# EAGLE design SWNUI (EAGLE 7.1.0)
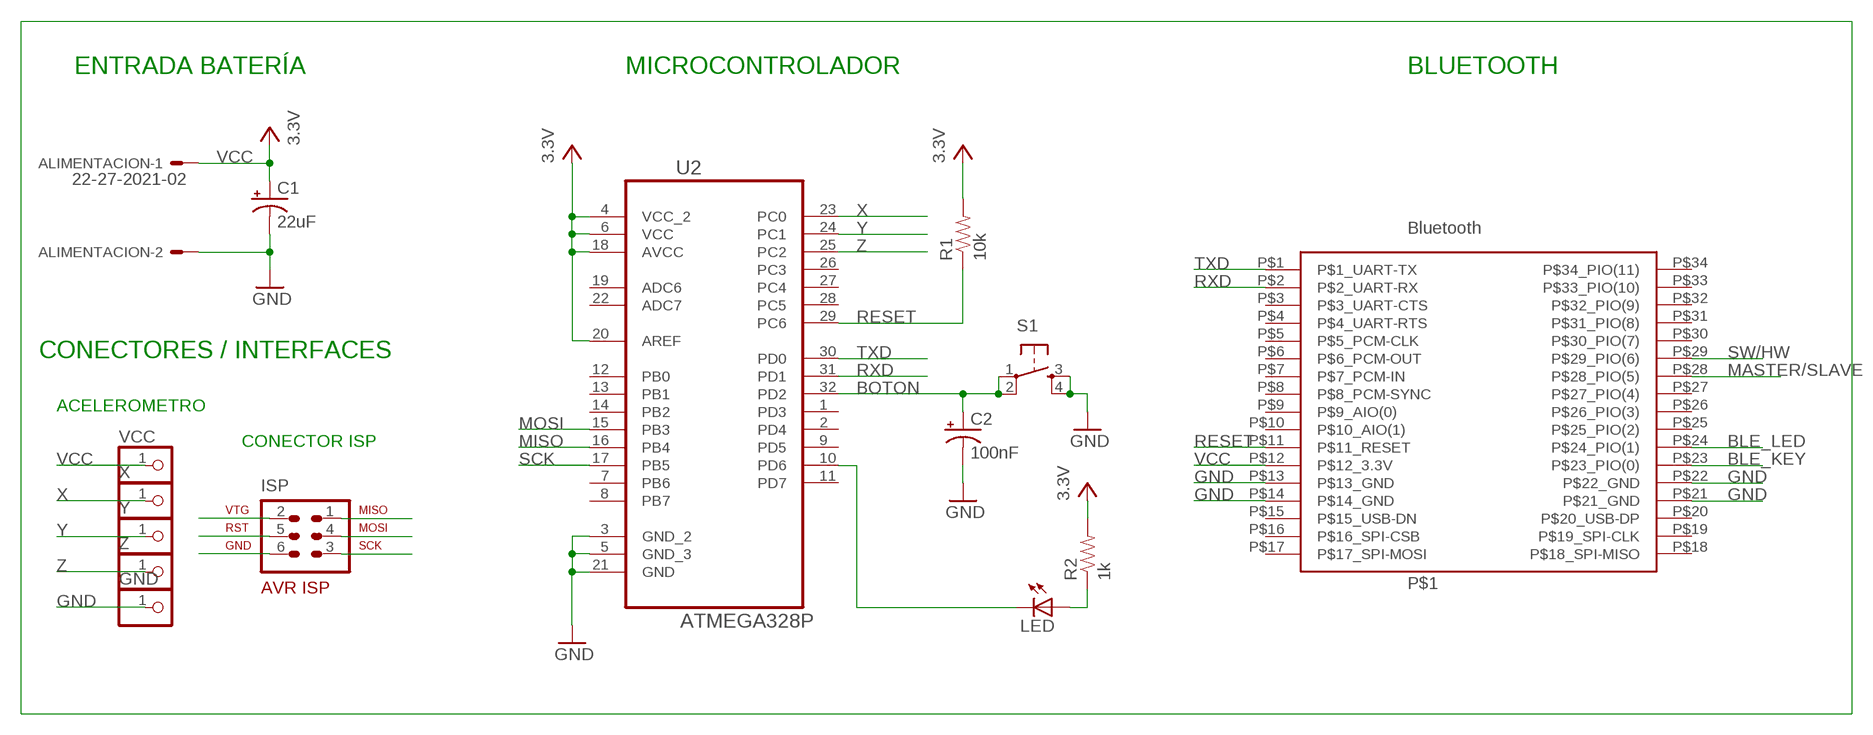
[diagram p0: schematic, sheet 1]

## Parts
ALIMENTACION  22-27-2021-02  [6410-02]
C1  22uF  CAP_POL1206  [EIA3216]
C2  100nF  CAP_POL1206  [EIA3216]
GND  PINHD-1X1  [1X01]
ISP  AVR-ISP-6  [AVR-ISP-6]
LED  LEDCHIP-LED0805  [CHIP-LED0805]
P$1  Bluetooth  BTM400-6B  [BTM400]
R1  10k  0.3OHM-1/8W-1%(0805)  [0805]
R2  1k  0.3OHM-1/8W-1%(0805)  [0805]
S1  TAC_SWITCHPTH  [TACTILE-PTH]
U2  ATMEGA328P  ATMEGA328P-AU  [QFP80P900X900X120-32N]
VCC  PINHD-1X1  [1X01]
X  PINHD-1X1  [1X01]
Y  PINHD-1X1  [1X01]
Z  PINHD-1X1  [1X01]

## Nets
BLE_KEY: P$1.P$23(P$23_PIO(0))
BLE_LED: P$1.P$24(P$24_PIO(1))
BOTON: C2.A(+) S1.1 S1.2 U2.32(PD2)
GND: ALIMENTACION.2 C1.C(-) C2.C(-) GND.1 ISP.6 P$1.P$13(P$13_GND) P$1.P$14(P$14_GND) P$1.P$21(P$21_GND) P$1.P$22(P$22_GND) S1.3 S1.4 U2.3(GND_2) U2.5(GND_3) U2.21(GND)
MASTER/SLAVE: P$1.P$28(P$28_PIO(5))
MISO: ISP.1 U2.16(PB4)
MOSI: ISP.4 U2.15(PB3)
N$1: LED.C U2.10(PD6)
N$4: LED.A R2.1
RESET: ISP.5 P$1.P$11(P$11_RESET) R1.1 U2.29(PC6)
RXD: P$1.P$2(P$2_UART-RX) U2.31(PD1)
SCK: ISP.3 U2.17(PB5)
SW/HW: P$1.P$29(P$29_PIO(6))
TXD: P$1.P$1(P$1_UART-TX) U2.30(PD0)
VCC: ALIMENTACION.1 C1.A(+) ISP.2 P$1.P$12(P$12_3.3V) R1.2 R2.2 U2.4(VCC_2) U2.6(VCC) U2.18(AVCC) U2.20(AREF) VCC.1 ; supply symbol labelled 3.3V
X: U2.23(PC0) X.1
Y: U2.24(PC1) Y.1
Z: U2.25(PC2) Z.1
Unconnected: P$1.P$3(P$3_UART-CTS) P$1.P$4(P$4_UART-RTS) P$1.P$5(P$5_PCM-CLK) P$1.P$6(P$6_PCM-OUT) P$1.P$7(P$7_PCM-IN) P$1.P$8(P$8_PCM-SYNC) P$1.P$9(P$9_AIO(0)) P$1.P$10(P$10_AIO(1)) P$1.P$15(P$15_USB-DN) P$1.P$16(P$16_SPI-CSB) P$1.P$17(P$17_SPI-MOSI) P$1.P$18(P$18_SPI-MISO) P$1.P$19(P$19_SPI-CLK) P$1.P$20(P$20_USB-DP) P$1.P$25(P$25_PIO(2)) P$1.P$26(P$26_PIO(3)) P$1.P$27(P$27_PIO(4)) P$1.P$30(P$30_PIO(7)) P$1.P$31(P$31_PIO(8)) P$1.P$32(P$32_PIO(9)) P$1.P$33(P$33_PIO(10)) P$1.P$34(P$34_PIO(11)) U2.1(PD3) U2.2(PD4) U2.7(PB6) U2.8(PB7) U2.9(PD5) U2.11(PD7) U2.12(PB0) U2.13(PB1) U2.14(PB2) U2.19(ADC6) U2.22(ADC7) U2.26(PC3) U2.27(PC4) U2.28(PC5)

## Notes on the sheet
- ENTRADA BATERÍA | MICROCONTROLADOR | BLUETOOTH
- CONECTORES / INTERFACES
- ACELEROMETRO
- CONECTOR ISP

## Library data of the parts
ALIMENTACION = con-molex:22-?-02: CONNECTOR wire to board 2.54 mm (.1 inch) pitch header; OC_FARNELL: unknown; OC_NEWARK: unknown
C1 C2 = SparkFun-Capacitors:CAP_POL: Capacitor Polarized These are standard SMD and PTH capacitors. Normally 10uF, 47uF, and 100uF in electrolytic and tantalum varieties. Always verify the external diameter of the through hole cap, it varies with capacity, voltage, and manufacturer. The EIA devices should be standard.
GND VCC X Y Z = pinhead:PINHD-1X1: PIN HEADER
ISP = avr-5:AVR-ISP-6: AVR ISP-6 Serial Programming Header
LED = led:LED: LED OSRAM: - CHIPLED LG R971, LG N971, LY N971, LG Q971, LY Q971, LO R971, LY R971 LH N974, LH R974 LS Q976, LO Q976, LY Q976 LO Q996 - Hyper CHIPLED LW Q18S LB Q993, LB Q99A, LB R99A - SideLED LS A670, LO A670, LY A670, LG A670, LP A670 LB A673, LV A673, LT A673, LW A673 LH A674 LY A675 LS A676, LA A676, LO A676, LY A676, LW A676 LS A679, LY A679, LG A679 - Hyper Micro SIDELED® LS Y876, LA Y876, LO Y876, LY Y876 LT Y87S - SmartLED LW L88C, LW L88S LB L89C, LB L89S, LG L890 LS L89K, LO L89K, LY L89K LS L896, LA L896, LO L896, LY L896 - TOPLED LS T670, LO T670, LY T670, LG T670, LP T670 LSG T670, LSP T670, LSY T670, LOP T670, LYG T670 LG T671, LOG T671, LSG T671 LB T673, LV T673, LT T673, LW T673 LH T674 LS T676, LA T676, LO T676, LY T676, LB T676, LH T676, LSB T676, LW T676 LB T67C, LV T67C, LT T67C, LS T67K, LO T67K, LY T67K, LW E67C LS E67B, LA E67B, LO E67B, LY E67B, LB E67C, LV E67C, LT E67C LW T67C LS T679, LY T679, LG T679 LS T770, LO T770, LY T770, LG T770, LP T770 LB T773, LV T773, LT T773, LW T773 LH T774 LS E675, LA E675, LY E675, LS T675 LS T776, LA T776, LO T776, LY T776, LB T776 LHGB T686 LT T68C, LB T68C - Hyper Mini TOPLED® LB M676 - Mini TOPLED Santana® LG M470 LS M47K, LO M47K, LY M47K Source: http://www.osram.convergy.de LUXEON: - LUMILED® LXK2-PW12-R00, LXK2-PW12-S00, LXK2-PW14-U00, LXK2-PW14-V00 LXK2-PM12-R00, LXK2-PM12-S00, LXK2-PM14-U00 LXK2-PE12-Q00, LXK2-PE12-R00, LXK2-PE12-S00, LXK2-PE14-T00, LXK2-PE14-U00 LXK2-PB12-K00, LXK2-PB12-L00, LXK2-PB12-M00, LXK2-PB14-N00, LXK2-PB14-P00, LXK2-PB14-Q00 LXK2-PR12-L00, LXK2-PR12-M00, LXK2-PR14-Q00, LXK2-PR14-R00 LXK2-PD12-Q00, LXK2-PD12-R00, LXK2-PD12-S00 LXK2-PH12-R00, LXK2-PH12-S00 LXK2-PL12-P00, LXK2-PL12-Q00, LXK2-PL12-R00 Source: www.luxeon.com KINGBRIGHT: KA-3528ASYC Source: www.kingbright.com
P$1 = btm400-6b:BTM400-6B: BTM400 6B Bluetooth Module 13mm x 26.9mm 34 pins
R1 R2 = SparkFun-Resistors:0.3OHM-1/8W-1%(0805): RES-11622; PROD_ID: RES-11622; VALUE: 0.3
S1 = SparkFun-Retired:TAC_SWITCH: Momentary Switch Button commonly used for reset or general input. Spark Fun Electronics SKU : COM-00097 SMT- SWCH-08247
U2 = Atmel_By_element14_Batch_1-00:ATMEGA328P-AU: 8-bit Microcontroller with In-System Programmable Flash; MPN: ATMEGA328P-AU; OC_FARNELL: 1715486; OC_NEWARK: 14R4631; PACKAGE: TQFP-32; SUPPLIER: Atmel

## Board
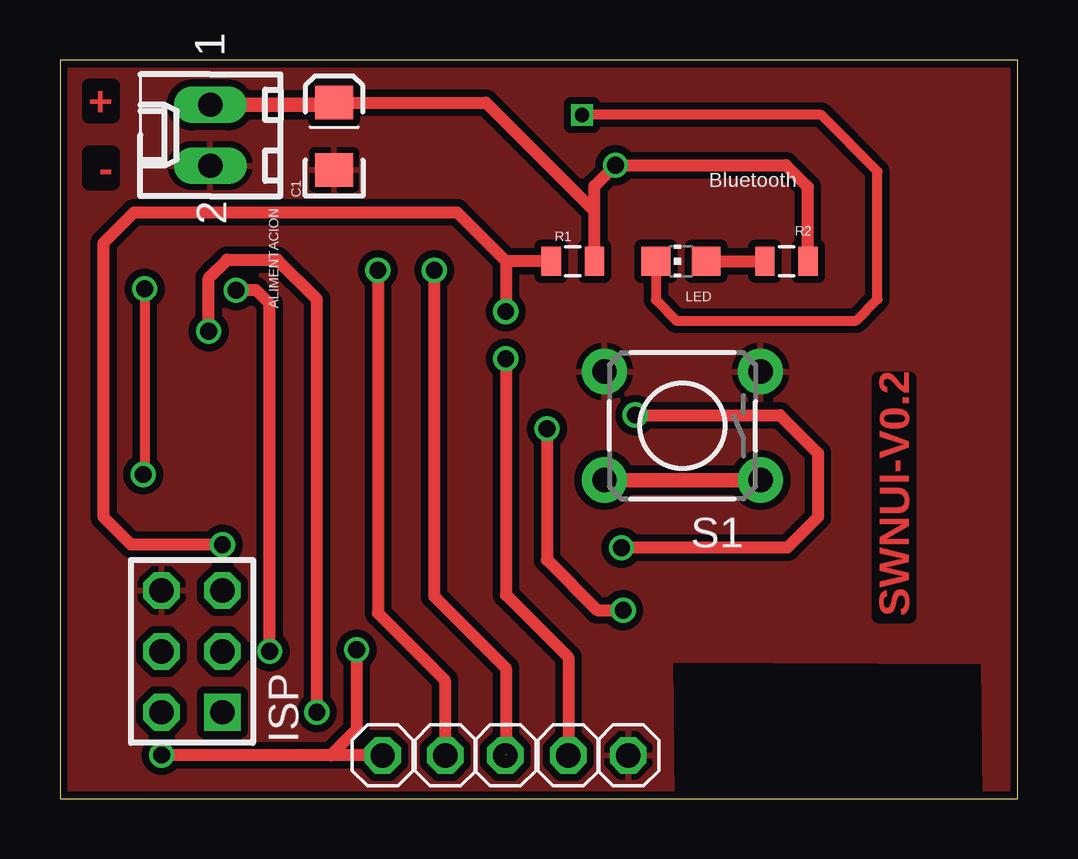
[diagram p1: board, top side]
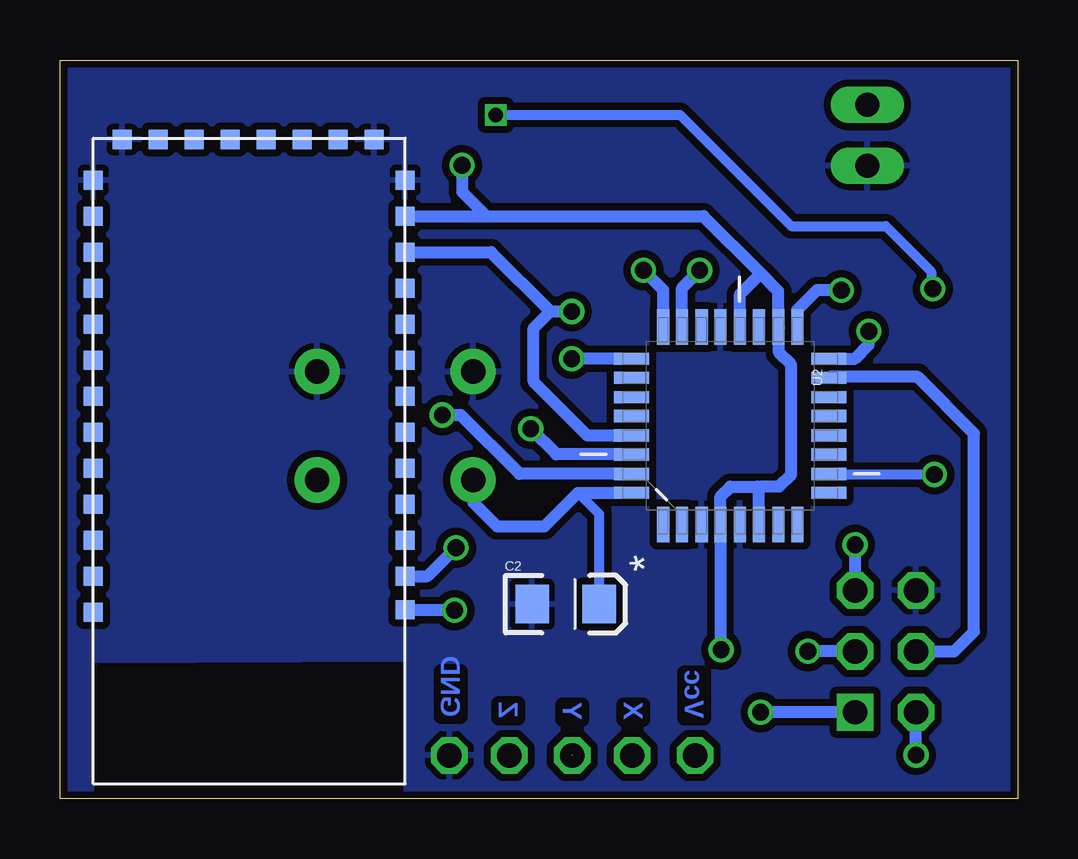
[diagram p2: board, bottom side, seen from below]

Size 39.92 x 30.79 mm. Coordinates in mm from the lower left corner, seen from the top.
Outline: 39.92,30.79 0,30.79 0,0 39.92,0 39.92,30.79
Copper layers (1*16): Top 0.035mm / dielectric 1.5mm / Bottom 0.035mm
Design rules "dirt_cheap_dirty_boards.v1": minimum track width 5mil, minimum drill 12mil, track to track 5mil, track to pad 5mil, pad to pad 5mil, via to via 5mil, smd to smd 0mil, copper to edge 10mil, drill to drill 10mil, minimum pad ring 10mil, minimum via ring 6mil, stop-mask expansion 2mil, vias tented up to drill 25mil, thermal gap 10mil

### Footprints (pad centres in the part's own frame; a part is rotated, then mirrored left to right if it is on the bottom)
6410-02 = drill 1.016 long: 1 1.27,0; 2 -1.27,0
EIA3216 = smd 1.4 x 1.6: A 1.4,0; C -1.4,0
1X01 = drill 1.016 octagon: 1 0,0
AVR-ISP-6 = drill 1.016 square: 1 -2.54,-1.27 | drill 1.016 octagon: 2 -2.54,1.27; 3 0,-1.27; 4 0,1.27; 5 2.54,-1.27; 6 2.54,1.27
CHIP-LED0805 = smd 1.2 x 1.2: A 0,-1.05; C 0,1.05
BTM400 = smd 0.8 x 0.8: P$1 -6.2,-6.5; P$2 -4.8,-6.5; P$3 -3.3,-6.5; P$4 -1.8,-6.5; P$5 -0.3,-6.5; P$6 1.2,-6.5; P$7 2.7,-6.5; P$8 4.2,-6.5; P$9 5.7,-6.5; P$10 7.2,-6.5; P$11 8.7,-6.5; P$12 10.2,-6.5; P$13 11.7,-6.5; P$14 13.4,-5.2; P$15 13.4,-3.7; P$16 13.4,-2.2; P$17 13.4,-0.7; P$18 13.4,0.8; P$19 13.4,2.3; P$20 13.4,3.8; P$21 13.4,5.3; P$22 11.7,6.5; P$23 10.2,6.5; P$24 8.7,6.5; P$25 7.2,6.5; P$26 5.7,6.5; P$27 4.2,6.5; P$28 2.7,6.5; P$29 1.2,6.5; P$30 -0.3,6.5; P$31 -1.8,6.5; P$32 -3.3,6.5; P$33 -4.8,6.5; P$34 -6.3,6.5
0805 = smd 0.8 x 1.2: 1 -0.9,0; 2 0.9,0
TACTILE-PTH = drill 1.016 pad 1.88: 1 -3.251,2.261; 2 3.251,2.261; 3 -3.251,-2.261; 4 3.251,-2.261
QFP80P900X900X120-32N = smd 1.473 x 0.508: 1 -4.115,2.794; 2 -4.115,2.007; 3 -4.115,1.194; 4 -4.115,0.406; 5 -4.115,-0.406; 6 -4.115,-1.194; 7 -4.115,-2.007; 8 -4.115,-2.794; 17 4.115,-2.794; 18 4.115,-2.007; 19 4.115,-1.194; 20 4.115,-0.406; 21 4.115,0.406; 22 4.115,1.194; 23 4.115,2.007; 24 4.115,2.794 | smd 0.508 x 1.473: 9 -2.794,-4.115; 10 -2.007,-4.115; 11 -1.194,-4.115; 12 -0.406,-4.115; 13 0.406,-4.115; 14 1.194,-4.115; 15 2.007,-4.115; 16 2.794,-4.115; 25 2.794,4.115; 26 2.007,4.115; 27 1.194,4.115; 28 0.406,4.115; 29 -0.406,4.115; 30 -1.194,4.115; 31 -2.007,4.115; 32 -2.794,4.115

### Placement (x,y rotation side)
ALIMENTACION  6.27,27.65 90 top
C1  11.43,27.61 90 top
C2  18.84,8.12 0 bottom
GND  23.69,1.81 180 top
ISP  5.5,6.15 90 top
LED  25.89,22.4 90 top
P$1  32.03,14.08 90 bottom
R1  21.38,22.4 0 top
R2  30.29,22.4 0 top
S1  25.95,15.54 180 top
U2  11.98,15.54 90 bottom
VCC  13.45,1.81 180 top
X  16.07,1.81 180 top
Y  18.57,1.81 180 top
Z  21.19,1.81 180 top

### Tracks (layer width: path | path; a pad name or v marks a point on that pad's centre or on a via)
BOTON
  Top 0.61: S1.1 S1.2
  Bottom 0.406: C2.A 17.44,11.86 18.33,12.75
  Bottom 0.5: S1.2 22.7,12.36 21.7,11.35 19.73,11.35 18.33,12.75 U2.32
GND
  pour Bottom (isolate 0.305): 39.92,30.79 39.92,0.03 38.6,-0.04 38.6,5.77 25.5,5.84 25.5,0.03 -0.04,0.03 -0.04,30.79
  pour Top (isolate 0.305): 39.92,30.82 39.92,0.03 38.6,-0.04 38.54,5.71 25.44,5.77 25.5,-0.01 -0.04,-0.01 -0.04,30.82
MISO  (via drill 0.7)
  Top 0.5: v6.2,19.48 6.2,21.7 6.96,22.47 9.06,22.47 10.71,20.82 v10.71,3.61
  Bottom 0.5: ISP.1 v10.71,3.61 | U2.16 6.77,18.34 6.2,18.91 v6.2,19.48
MOSI
  Bottom 0.5: U2.15 7.84,17.58 4.17,17.58 1.82,15.23 1.82,6.97 2.65,6.15 ISP.4
N$1  (via drill 0.6, 0.7)
  Top 0.406: LED.C 24.84,20.79 25.7,19.93 33.19,19.93 34.08,20.82 34.08,26.15 31.73,28.5 v21.76,28.5 | v3.54,21.26 3.54,13.58 v3.47,13.51
  Bottom 0.406: v21.76,28.5 14.08,28.5 9.44,23.86 5.5,23.86 3.6,21.96 3.6,21.32 v3.54,21.26 | v3.47,13.51 7.84,13.51 U2.10
N$4
  Top 0.5: LED.A 29.38,22.4 R2.1
RESET  (via drill 0.7)
  Top 0.5: v6.77,10.59 2.96,10.59 1.82,11.73 1.82,23.17 3.09,24.44 16.55,24.44 18.59,22.4 | 18.59,22.4 v18.59,20.31 | R1.1 18.59,22.4
  Bottom 0.5: ISP.5 v6.77,10.59 | P$1.P$11 21.95,22.78 19.47,20.31 | 19.47,20.31 v18.59,20.31 | U2.29 17.93,15.14 20.17,17.39 20.17,19.61 19.47,20.31
RXD  (via drill 0.7)
  Top 0.5: v23.98,15.99 30.02,15.99 31.6,14.4 31.6,11.73 30.33,10.47 v23.41,10.47
  Bottom 0.5: P$1.P$2 24.6,9.28 v23.41,10.47 | U2.31 20.77,13.54 23.22,15.99 v23.98,15.99
SCK  (via drill 0.7)
  Top 0.5: v7.35,21.2 8.17,21.2 8.74,20.63 v8.74,6.15
  Bottom 0.5: v7.35,21.2 8.36,21.2 9.19,20.37 U2.17 | ISP.3 v8.74,6.15
TXD  (via drill 0.7)
  Top 0.5: v20.3,15.42 20.3,9.96 22.4,7.86 v23.47,7.86
  Bottom 0.5: v23.47,7.86 25.52,7.86 P$1.P$1 | U2.30 19.23,14.35 v20.3,15.42
VCC  (via drill 0.7)
  Top 0.5: VCC.1 11.28,1.81 | 11.28,1.81 4.25,1.81 v4.23,1.83 | v12.36,6.21 12.36,2.89 11.28,1.81 | R1.2 22.28,24.49 | C1.A 17.76,29.01 22.28,24.49 | 22.28,24.49 22.28,25.53 v23.16,26.4 30.27,26.4 31.19,25.49 R2.2
  Top 0.61: ALIMENTACION.1 11.34,28.92 C1.A
  Bottom 0.406: 25.69,24.24 P$1.P$12
  Bottom 0.5: 10.71,21.9 9.97,21.16 U2.18 9.95,19.63 9.95,18.59 9.44,18.09 9.44,13.51 9.95,13.01 10.71,13.01 10.79,12.93 | U2.20 11.58,21.03 10.71,21.9 | P$1.P$12 22.14,24.28 | 22.14,24.28 13.09,24.28 10.71,21.9 | v4.23,1.83 ISP.2 | U2.6 10.79,12.93 | 10.79,12.93 10.86,13.01 11.98,13.01 12.39,12.6 U2.4 12.39,6.24 v12.36,6.21 | v23.16,26.4 23.16,25.29 22.14,24.28
X  (via drill 0.7)
  Top 0.5: v13.25,22.02 13.25,7.73 16.05,4.94 16.05,1.84 X.1
  Bottom 0.5: U2.23 13.99,21.29 v13.25,22.02
Y  (via drill 0.7)  (1 unrouted)
  Top 0.5: v15.6,22.02 15.6,8.43 18.59,5.45 18.59,1.83
  Bottom 0.5: U2.24 14.78,21.2 v15.6,22.02
Z  (via drill 0.7)
  Top 0.5: v18.59,18.34 18.59,8.5 21.19,5.89 Z.1
  Bottom 0.5: U2.25 v18.59,18.34

### Text on the board
Top: + | - | SWNUI-V0.2
Bottom: Vcc | X | Y | Z | GND